# Altium schematic sheet 00 - TitlePage.SchDoc: Top Level Design
size A4; DocumentNumber: 2; Revision: 1; SheetNumber: 2; SheetTotal: 8; ProjectName: FishWand
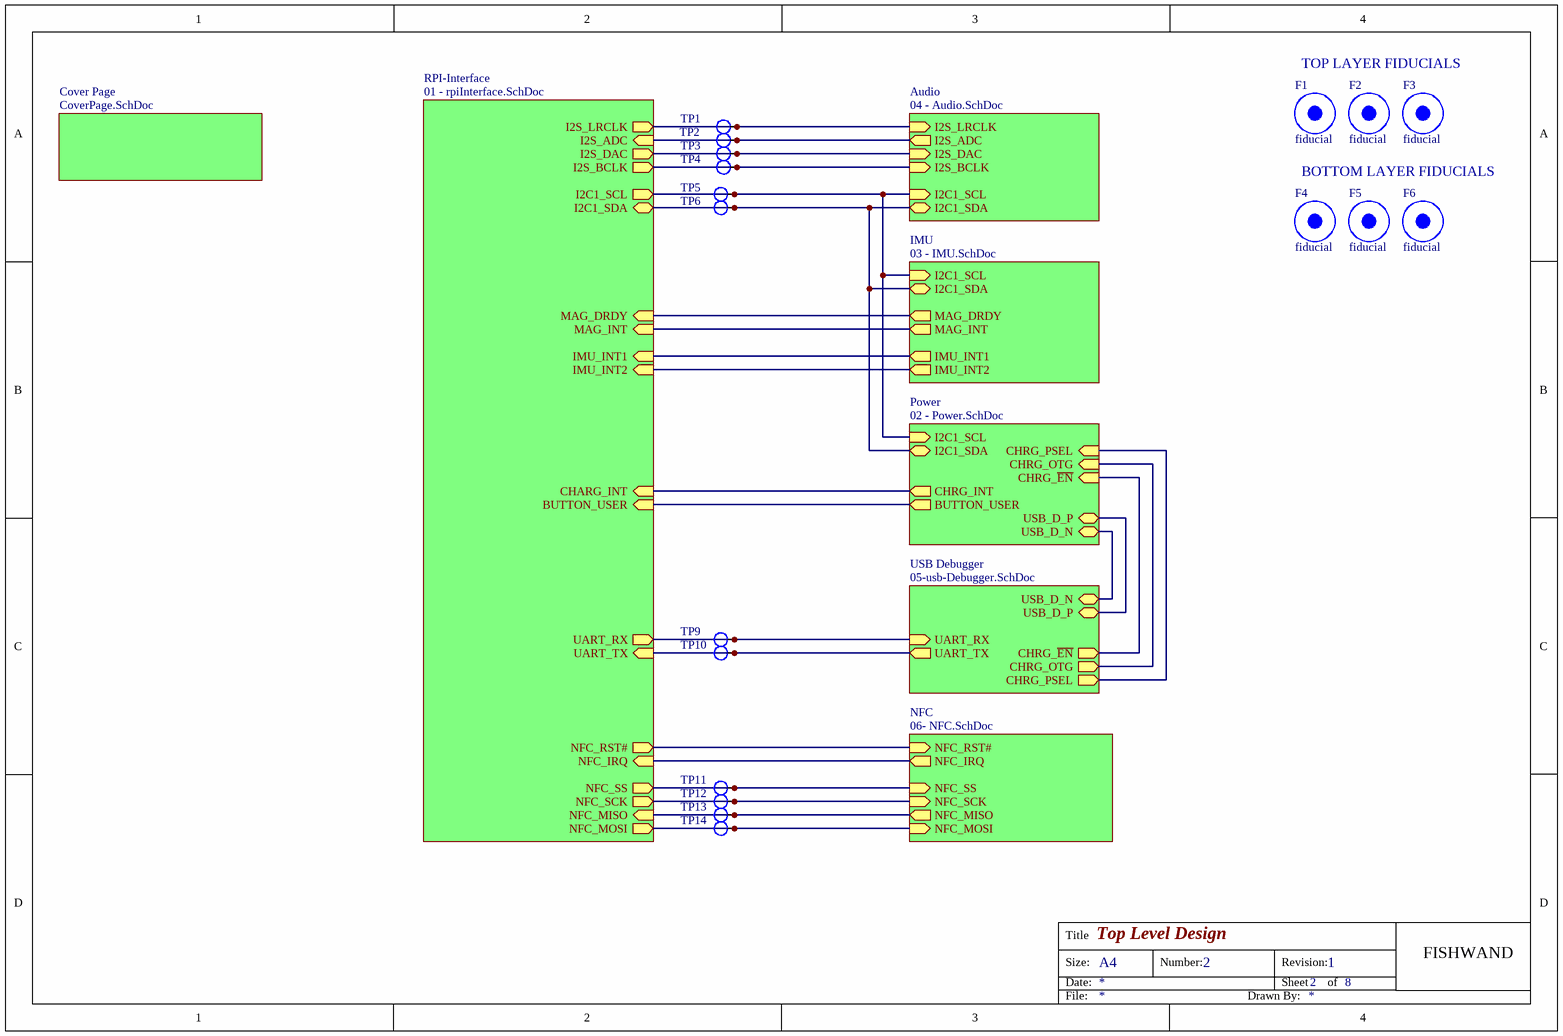
[diagram p0: 00 - TitlePage.SchDoc]

## Parts
F1  fiducial  [fiducial_marker]  (no BOM)
F2  fiducial  [fiducial_marker]  (no BOM)
F3  fiducial  [fiducial_marker]  (no BOM)
F4  fiducial  [fiducial_marker]  (no BOM)
F5  fiducial  [fiducial_marker]  (no BOM)
F6  fiducial  [fiducial_marker]  (no BOM)
TP1  Test Point  [tp_1mm]  (value not drawn)  (no BOM)
TP2  Test Point  [tp_1mm]  (value not drawn)  (no BOM)
TP3  Test Point  [tp_1mm]  (value not drawn)  (no BOM)
TP4  Test Point  [tp_1mm]  (value not drawn)  (no BOM)
TP5  Test Point  [tp_1mm]  (value not drawn)  (no BOM)
TP6  Test Point  [tp_1mm]  (value not drawn)  (no BOM)
TP9  Test Point  [tp_1mm]  (value not drawn)  (no BOM)
TP10  Test Point  [tp_1mm]  (value not drawn)  (no BOM)
TP11  Test Point  [tp_1mm]  (value not drawn)  (no BOM)
TP12  Test Point  [tp_1mm]  (value not drawn)  (no BOM)
TP13  Test Point  [tp_1mm]  (value not drawn)  (no BOM)
TP14  Test Point  [tp_1mm]  (value not drawn)  (no BOM)

## Sub-sheets
Audio = 04 - Audio.SchDoc: I2C1_SCL (in), I2S_BCLK (in), I2S_DAC (in), I2S_ADC (out), I2S_LRCLK (in), I2C1_SDA (bidir)
Cover Page = CoverPage.SchDoc: no entries
IMU = 03 - IMU.SchDoc: I2C1_SDA (bidir), I2C1_SCL (in), MAG_DRDY (out), MAG_INT (out), IMU_INT2 (out), IMU_INT1 (out)
NFC = 06- NFC.SchDoc: NFC_RST# (in), NFC_IRQ (out), NFC_SS (in), NFC_SCK (in), NFC_MISO (out), NFC_MOSI (in)
Power = 02 - Power.SchDoc: I2C1_SCL (in), I2C1_SDA (bidir), CHRG_INT (out), USB_D_P, USB_D_N, CHRG_~{EN} (in), CHRG_PSEL (in), BUTTON_USER (out), CHRG_OTG (in)
RPI-Interface = 01 - rpiInterface.SchDoc: I2C1_SCL (out), I2C1_SDA (bidir), UART_TX (in), I2S_LRCLK (out), CHARG_INT (in), I2S_ADC (in), I2S_BCLK (out), UART_RX (out), I2S_DAC (out), BUTTON_USER (in), NFC_IRQ (in), NFC_RST# (out), NFC_MISO (in), NFC_MOSI (out), NFC_SCK (out), NFC_SS (out), IMU_INT1 (in), IMU_INT2 (in), MAG_INT (in), MAG_DRDY (in)
USB Debugger = 05-usb-Debugger.SchDoc: CHRG_PSEL (out), USB_D_P, CHRG_~{EN} (out), CHRG_OTG (out), USB_D_N, UART_RX (in), UART_TX (out)

## Nets
NetTP1_1: TP1.1 ; sheet RPI-Interface/I2S_LRCLK, sheet Audio/I2S_LRCLK
NetTP2_1: TP2.1 ; sheet RPI-Interface/I2S_ADC, sheet Audio/I2S_ADC
NetTP3_1: TP3.1 ; sheet RPI-Interface/I2S_DAC, sheet Audio/I2S_DAC
NetTP4_1: TP4.1 ; sheet RPI-Interface/I2S_BCLK, sheet Audio/I2S_BCLK
NetTP5_1: TP5.1 ; sheet RPI-Interface/I2C1_SCL, sheet Power/I2C1_SCL, sheet Audio/I2C1_SCL, sheet IMU/I2C1_SCL
NetTP6_1: TP6.1 ; sheet RPI-Interface/I2C1_SDA, sheet Power/I2C1_SDA, sheet Audio/I2C1_SDA, sheet IMU/I2C1_SDA
NetTP9_1: TP9.1 ; sheet RPI-Interface/UART_RX, sheet USB Debugger/UART_RX
NetTP10_1: TP10.1 ; sheet RPI-Interface/UART_TX, sheet USB Debugger/UART_TX
NetTP11_1: TP11.1 ; sheet RPI-Interface/NFC_SS, sheet NFC/NFC_SS
NetTP12_1: TP12.1 ; sheet RPI-Interface/NFC_SCK, sheet NFC/NFC_SCK
NetTP13_1: TP13.1 ; sheet RPI-Interface/NFC_MISO, sheet NFC/NFC_MISO
NetTP14_1: TP14.1 ; sheet RPI-Interface/NFC_MOSI, sheet NFC/NFC_MOSI
(unnamed): sheet RPI-Interface/CHARG_INT, sheet Power/CHRG_INT
(unnamed): sheet RPI-Interface/BUTTON_USER, sheet Power/BUTTON_USER
(unnamed): sheet RPI-Interface/NFC_IRQ, sheet NFC/NFC_IRQ
(unnamed): sheet RPI-Interface/NFC_RST#, sheet NFC/NFC_RST#
(unnamed): sheet RPI-Interface/IMU_INT1, sheet IMU/IMU_INT1
(unnamed): sheet RPI-Interface/IMU_INT2, sheet IMU/IMU_INT2
(unnamed): sheet RPI-Interface/MAG_INT, sheet IMU/MAG_INT
(unnamed): sheet RPI-Interface/MAG_DRDY, sheet IMU/MAG_DRDY
(unnamed): sheet Power/USB_D_P, sheet USB Debugger/USB_D_P
(unnamed): sheet Power/USB_D_N, sheet USB Debugger/USB_D_N
(unnamed): sheet Power/CHRG_~{EN}, sheet USB Debugger/CHRG_~{EN}
(unnamed): sheet Power/CHRG_PSEL, sheet USB Debugger/CHRG_PSEL
(unnamed): sheet Power/CHRG_OTG, sheet USB Debugger/CHRG_OTG

## Notes on the sheet
- TOP LAYER FIDUCIALS
- BOTTOM LAYER FIDUCIALS
- Title
- Size:
- Date:
- A4
- Number:
- Revision:
- Sheet
- of
- FISHWAND
- File:
- Drawn By:

## Library data of the parts
F1-F6 = fiducial_marker
TP1-TP6 TP9-TP14 = TP_1mm